# Altium schematic sheet POWER.SchDoc
size A; SheetNumber: 3; SheetTotal: 8
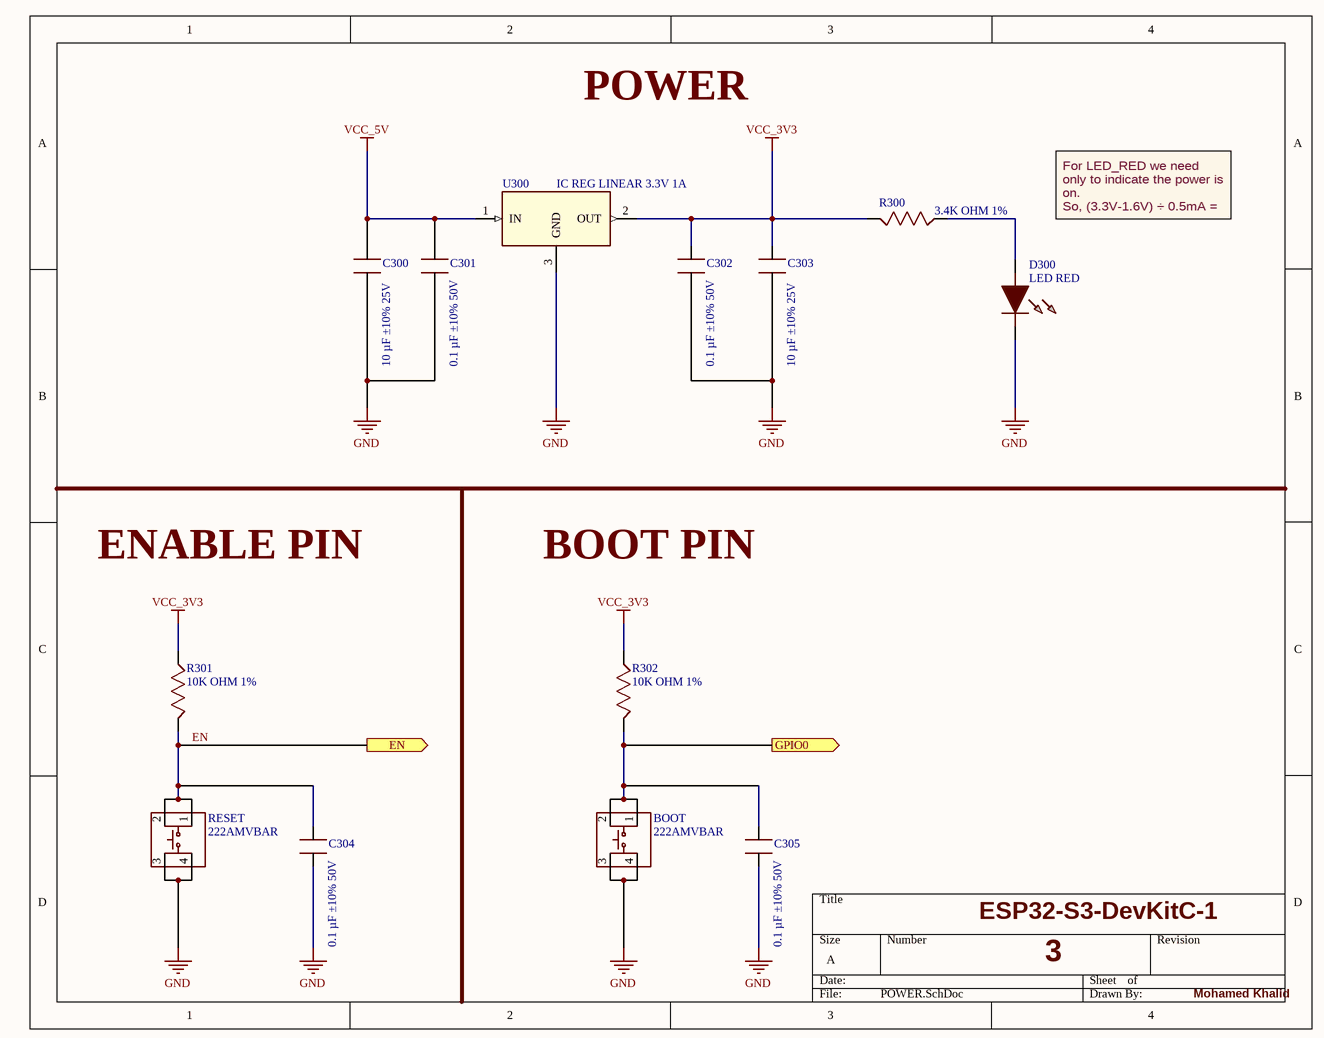
[diagram p0: POWER.SchDoc, right]

## Parts
BOOT  222AMVBAR  [222AMVBAR]
C300  10 µF ±10% 25V  [CAPC2012X145N]
C301  0.1 µF ±10% 50V  [CAPC1608X90N]
C302  0.1 µF ±10% 50V  [CAPC1608X90N]
C303  10 µF ±10% 25V  [CAPC2012X145N]
C304  0.1 µF ±10% 50V  [CAPC1608X90N]
C305  0.1 µF ±10% 50V  [CAPC1608X90N]
D300  LED RED  [5988A10107F]
R300  3.4K OHM 1%  [RESC2012X65N]
R301  10K OHM 1%  [RESC2012X65N]
R302  10K OHM 1%  [RESC2012X65N]
RESET  222AMVBAR  [222AMVBAR]
U300  IC REG LINEAR 3.3V 1A  [KC_3_ADI]

## Ports
EN (out, see AUTO_PROGRAMMING[4B], ESP32-S3-WROOM-1U[2B], PIN-HEADERS[2A]), GPIO0 (out, see AUTO_PROGRAMMING[4C], ESP32-S3-WROOM-1U[3C], PIN-HEADERS[3B])

## Nets
GND: BOOT.3(COM_2) BOOT.4(NO_2) C300.1 C301.1 C302.1 C303.1 C304.1 C305.1 D300.2(A) RESET.3(COM_2) RESET.4(NO_2) U300.3(GND)
VCC_3V3: C302.2 C303.2 R300.1 R301.2 R302.2 U300.2(OUT)
VCC_5V: C300.2 C301.2 U300.1(IN)
EN: C304.2 R301.1 RESET.1(COM_1) RESET.2(NO_1) ; port EN
GPIO0: BOOT.1(COM_1) BOOT.2(NO_1) C305.2 R302.1 ; port GPIO0
NetD300_1: D300.1(K) R300.2

## Notes on the sheet
- POWER
- For LED_RED we need only to indicate the power is on.
  So, (3.3V-1.6V) ÷ 0.5mA = 3.4K OHM
- ENABLE PIN
- BOOT PIN
- ESP32-S3-DevKitC-1
- 3
- Mohamed Khalid

## Library data of the parts
BOOT RESET = 222AMVBAR: Tactile Switches Gull Wing AF 160gf Act. Dir. Vertical; Manufacturer_Name: CTS; Geometry.Height: 5.2mm; Manufacturer_Part_Number: 222AMVBAR; Mouser Part Number: 774-222AMVBAR; Mouser Price/Stock: https://www.mouser.co.uk/ProductDetail/CTS-Electronic-Components/222AMVBAR?qs=%252BiOMRfgENTH99oc01%252BgePw%3D%3D; Arrow Part Number: 222AMVBAR; Arrow Price/Stock: https://www.arrow.com/en/products/222amvbar/cts; Datasheet Link: https://www.ctscorp.com/wp-content/uploads/222A.pdf
C300 C303 = CL21A106KAYNNNE: 10 µF ±10% 25V Ceramic Capacitor X5R 0805 (2012 Metric); Value: 10 µF; Tolerance: ±10%; Voltage - Rated: 25V
C301 C302 C304 C305 = CL10B104KB8NNNC: 0.1 µF ±10% 50V Ceramic Capacitor X7R 0603 (1608 Metric); Value: 0 .1 µF; Tolerance: ±10%; Voltage - Rated: 50 V
D300 = 5988A10107F: 598 A SMD LED 0402 pkg Red 635nm Low Current 5ma 7" Reel; Voltage - Forward (Vf) (Typ): 1.6V; Current - Forward (mA): 20; Reverse Voltage (V): 5
R300 = RMCF0805FT3K40: 3.4 kOhms ±1% 0.125W, 1/8W Chip Resistor 0805 (2012 Metric) Automotive AEC-Q200 Thick Film; Value: 3.4 kOhms; Tolerance: ±1%; Power (Watts): 0.125W, 1/8W
R301 R302 = RMCF0805FT10K0: 10 kOhms ±1% 0.125W, 1/8W Chip Resistor 0805 (2012 Metric) Automotive AEC-Q200 Thick Film; Value: 10 kOhms; Tolerance: ±1%; Power (Watts): 1/8W
U300 = ADP3338AKCZ-3.3RL7: Linear Voltage Regulator IC Positive Fixed 1 Output 1A SOT-223-3; Voltage - Input (Max): 8V; Voltage Dropout (Max): 0.4V @ 1A; Voltage - Output (Min/Fixed): 3.3V; Current - Output: 1A